# Altium schematic sheet Microcontroller.SchDoc: Microcontroller Sheet (part 1 of 2)
size A3; Author: Kubilay Közleme; Organization: My Company; Address1: Address Line 1; Address2: Address Line 2; Address3: Address Line 3; Address4: Address Line 4; SheetNumber: 3; SheetTotal: 5; ProjectTitle: Drone Fligth Controller
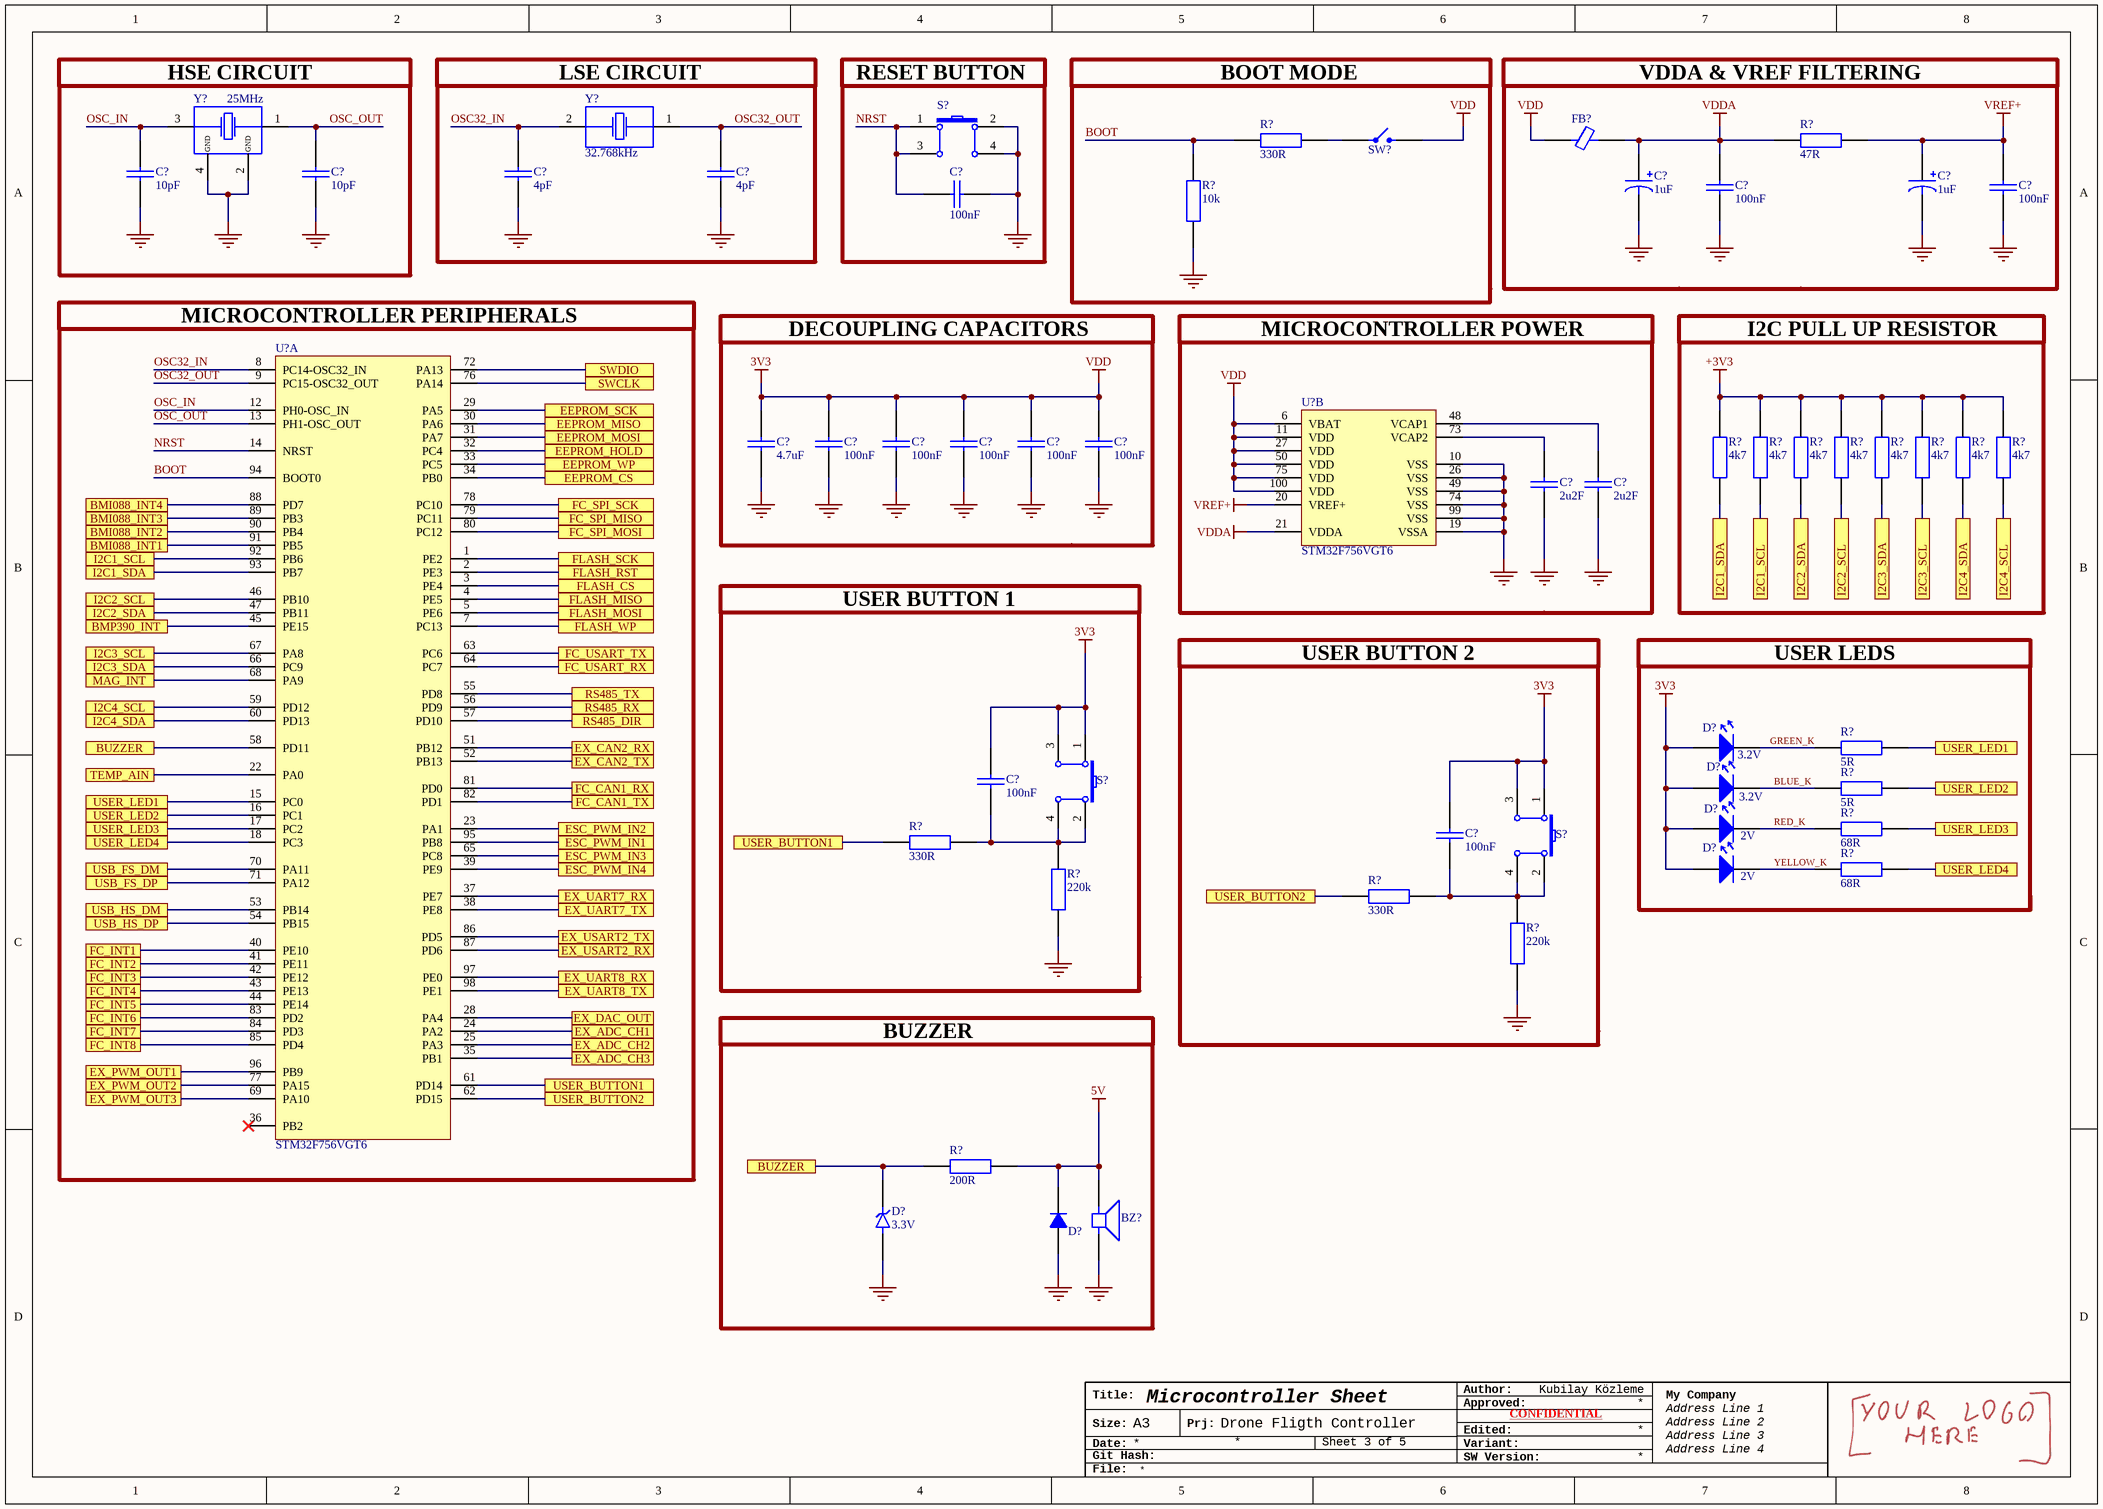
[diagram p0: Microcontroller.SchDoc]

## Parts
(Parts that share a designator on the sheet are numbered #1, #2 ... from top to bottom, then left to right.)
BZ?  CT-1205CL-SMT-TR  [CT-1205CL-SMT-TR]  (value not drawn)
C?#1  Capacitance: 10pF  [CAP_0603]  (hidden comment: C0201C100D3GACTU)
C?#2  Capacitance: 10pF  [CAP_0603]  (hidden comment: C0201C100D3GACTU)
C?#3  value 1uF  [CAP TANT POLAR 0805]  (hidden comment: T58W9105M035C0500)
C?#4  value 1uF  [CAP TANT POLAR 0805]  (hidden comment: T58W9105M035C0500)
C?#5  Capacitance: 100nF  [CAP_0603]  (hidden comment: C0603C104K1RACTU)
C?#6  Capacitance: 4pF  [CAP_0603]  (hidden comment: CBR06C409B5GAC)
C?#7  Capacitance: 4pF  [CAP_0603]  (hidden comment: CBR06C409B5GAC)
C?#8  Capacitance: 100nF  [CAP_0603]  (hidden comment: C0603C104K1RACTU)
C?#9  Capacitance: 100nF  [CAP_0603]  (hidden comment: C0603C104K1RACTU)
C?#10  Capacitance: 4.7uF  [CAP_0805]  (hidden comment: CL21A475KAQNNNE)
C?#11  Capacitance: 100nF  [CAP_0603]  (hidden comment: C0603C104K1RACTU)
C?#12  Capacitance: 100nF  [CAP_0603]  (hidden comment: C0603C104K1RACTU)
C?#13  Capacitance: 100nF  [CAP_0603]  (hidden comment: C0603C104K1RACTU)
C?#14  Capacitance: 100nF  [CAP_0603]  (hidden comment: C0603C104K1RACTU)
C?#15  Capacitance: 100nF  [CAP_0603]  (hidden comment: C0603C104K1RACTU)
C?#16  Capacitance: 2u2F  [CAP_0603]  (hidden comment: CL10A225KO8NNNC)
C?#17  Capacitance: 2u2F  [CAP_0603]  (hidden comment: CL10A225KO8NNNC)
C?#18  Capacitance: 100nF  [CAP_0603]  (hidden comment: C0603C104K1RACTU)
C?#19  Capacitance: 100nF  [CAP_0603]  (hidden comment: C0603C104K1RACTU)
D?#1  Forward Voltage: 3.2V  [LED GREEN CLEAR 0603 SMD]  (hidden comment: 150060GS75000)
D?#2  Forward Voltage: 3.2V  [LED GREEN CLEAR 0603 SMD]  (hidden comment: LED BLUE CLEAR 0603 SMD)
D?#3  Forward Voltage: 2V  [LED GREEN CLEAR 0603 SMD]  (hidden comment: 150060RS75000)
D?#4  Forward Voltage: 2V  [LED GREEN CLEAR 0603 SMD]  (hidden comment: LED YELLOW CLEAR 0603 SMD)
D?#5  1N4148WS  [SOD-323F]  (value not drawn)
D?#6  Zener Voltage: 3.3V  [SOD123]  (hidden comment: MMSZ4684T1G)
FB?  FCM 1608KF-601T03  [FCM 1608KF-601T03]  (value not drawn)
R?#1  Resistance: 330R  [RES_0603]  (hidden comment: RC0603JR-07330RL)
R?#2  Resistance: 47R  [RES_0603]  (hidden comment: RC0603FR-0747RL)
R?#3  Resistance: 10k  [RES_0603]  (hidden comment: RC0603FR-0710KL)
R?#4  Resistance: 4k7  [RES_0603]  (hidden comment: RC0603JR-074K7L)
R?#5  Resistance: 4k7  [RES_0603]  (hidden comment: RC0603JR-074K7L)
R?#6  Resistance: 4k7  [RES_0603]  (hidden comment: RC0603JR-074K7L)
R?#7  Resistance: 4k7  [RES_0603]  (hidden comment: RC0603JR-074K7L)
R?#8  Resistance: 4k7  [RES_0603]  (hidden comment: RC0603JR-074K7L)
R?#9  Resistance: 4k7  [RES_0603]  (hidden comment: RC0603JR-074K7L)
R?#10  Resistance: 4k7  [RES_0603]  (hidden comment: RC0603JR-074K7L)
R?#11  Resistance: 4k7  [RES_0603]  (hidden comment: RC0603JR-074K7L)
R?#12  Resistor Value: 5R  [RES_0603]  (hidden comment: CSRT0603FT5R00)
R?#13  Resistor Value: 5R  [RES_0603]  (hidden comment: CSRT0603FT5R00)
R?#14  Resistance: 68R  [RES_0603]  (hidden comment: RC0603FR-0768RL)
R?#15  Resistance: 330R  [RES_0603]  (hidden comment: RC0603JR-07330RL)
R?#16  Resistance: 68R  [RES_0603]  (hidden comment: RC0603FR-0768RL)
R?#17  Resistance: 330R  [RES_0603]  (hidden comment: RC0603JR-07330RL)
R?#18  value 220k  [RES_0603]  (hidden comment: RC0603JR-07220KL)
R?#19  value 220k  [RES_0603]  (hidden comment: RC0603JR-07220KL)
R?#20  Resistor Value: 200R  [RES_0805]  (hidden comment: RC0805FR-07200RL)
S?#1  PTS 647 SN50 SMTR2 LFS  [PTS 647 SN50 SMTR2 LFS]  (value not drawn)
S?#2  PTS 647 SN50 SMTR2 LFS  [PTS 647 SN50 SMTR2 LFS]  (value not drawn)
S?#3  PTS 647 SN50 SMTR2 LFS  [PTS 647 SN50 SMTR2 LFS]  (value not drawn)
SW?  CHS-01TA  [CHS-01TA]  (value not drawn)
U?#1  STM32F756VGT6  [LQFP-100]  (part A of 2)
U?#2  STM32F756VGT6  [LQFP-100]  (part B of 2)
Y?#1  value 25MHz  [ECS]  (hidden comment: ECS-250-10-37B-CTN-TR)
Y?#2  value 32.768kHz  [ECS-.327-7-16-C-TR]  (hidden comment: ECS-.327-7-16-C-TR)

## Blocks framed on the sheet
HSE CIRCUIT: C?#1 C?#2 Y?#1
LSE CIRCUIT: C?#6 C?#7 Y?#2
RESET BUTTON: C?#5 S?#1
BOOT MODE: R?#1 R?#3 SW?
MICROCONTROLLER PERIPHERALS: U?#1
MICROCONTROLLER POWER: C?#16 C?#17 U?#2
I2C PULL UP RESISTOR: R?#4-R?#11
BUZZER: BZ? D?#5 D?#6 R?#20

## Ports
BMI088_INT1 (see Peripherals[3A]), BMI088_INT2 (see Peripherals[3A]), BMI088_INT3 (see Peripherals[3A]), BMI088_INT4 (see Peripherals[3A]), BMP390_INT (see Peripherals[2B]), BUZZER (see Microcontroller[1B]), BUZZER (see Microcontroller[3D]), EEPROM_CS (see Peripherals[3B]), EEPROM_HOLD (see Peripherals[3B]), EEPROM_MISO (see Peripherals[3B]), EEPROM_MOSI (see Peripherals[3B]), EEPROM_SCK (see Peripherals[3B]), EEPROM_WP (see Peripherals[3B]), ESC_PWM_IN1 (see Connector[5A]), ESC_PWM_IN2 (see Connector[6A]), ESC_PWM_IN3 (see Connector[5A]), ESC_PWM_IN4 (see Connector[6A]), EX_ADC_CH1 (see Connector[7C]), EX_ADC_CH2 (see Connector[7C]), EX_ADC_CH3 (see Connector[7C]), EX_CAN2_RX (see Connector[3B]), EX_CAN2_TX (see Connector[3B]), EX_DAC_OUT (see Connector[7C]), EX_PWM_OUT1 (see Connector[7D]), EX_PWM_OUT2 (see Connector[7D]), EX_PWM_OUT3 (see Connector[7D]), EX_UART7_RX (see Connector[7B]), EX_UART7_TX (see Connector[7B]), EX_UART8_RX (see Connector[7B]), EX_UART8_TX (see Connector[7B]), EX_USART2_RX (see Connector[7A]), EX_USART2_TX (see Connector[7A]), FC_CAN1_RX (see Connector[1B]), FC_CAN1_TX (see Connector[1B]), FC_INT1 (see Connector[1C]), FC_INT2 (see Connector[1C]), FC_INT3 (see Connector[1C]), FC_INT4 (see Connector[1C]), FC_INT5 (see Connector[1C]), FC_INT6 (see Connector[1C]), FC_INT7 (see Connector[1C]), FC_INT8 (see Connector[1C]), FC_SPI_MISO (see Connector[1C]), FC_SPI_MOSI (see Connector[1C]), FC_SPI_SCK (see Connector[1C]), FC_USART_RX (see Connector[1B]), FC_USART_TX (see Connector[1B]), FLASH_CS (see Peripherals[1C]), FLASH_MISO (see Peripherals[1B]), FLASH_MOSI (see Peripherals[1B]), FLASH_RST (see Peripherals[2B]), FLASH_SCK (see Peripherals[1B]), FLASH_WP (see Peripherals[2B]), I2C1_SCL (see Microcontroller[1B], Peripherals[1A]), I2C1_SCL (see Microcontroller[7B], Peripherals[1A]), I2C1_SDA (see Microcontroller[1B], Peripherals[1A]), I2C1_SDA (see Microcontroller[7B], Peripherals[1A]), I2C2_SCL (see Microcontroller[1B], Peripherals[2B]), I2C2_SCL (see Microcontroller[8B], Peripherals[2B]), I2C2_SDA (see Microcontroller[1B], Peripherals[2B]), I2C2_SDA (see Microcontroller[7B], Peripherals[2B]), I2C3_SCL (see Microcontroller[1B], Peripherals[5A], Peripherals[5B]), I2C3_SCL (see Microcontroller[8B], Peripherals[5A], Peripherals[5B]), I2C3_SDA (see Microcontroller[1B], Peripherals[5A], Peripherals[5B]), I2C3_SDA (see Microcontroller[8B], Peripherals[5A], Peripherals[5B]), I2C4_SCL (see Connector[1B], Connector[7C], Microcontroller[1B]), I2C4_SCL (see Connector[1B], Connector[7C], Microcontroller[8B]), I2C4_SDA (see Connector[1B], Connector[7C], Microcontroller[1B]), I2C4_SDA (see Connector[1B], Connector[7C], Microcontroller[8B]), MAG_INT (see Peripherals[5A]), RS485_DIR, RS485_RX, RS485_TX, SWCLK (see Connector[2D]), SWDIO (see Connector[2D]), TEMP_AIN, USB_FS_DM (see Connector[4A]), USB_FS_DP (see Connector[4A]), USB_HS_DM (see Connector[6C]), USB_HS_DP (see Connector[6C]), USER_BUTTON1 (see Microcontroller[3C]), USER_BUTTON2 (see Microcontroller[3C]), USER_BUTTON2 (see Microcontroller[5C]), USER_LED1 (see Microcontroller[1C]), USER_LED1 (see Microcontroller[8B]), USER_LED2 (see Microcontroller[1C]), USER_LED2 (see Microcontroller[8C]), USER_LED3 (see Microcontroller[1C]), USER_LED3 (see Microcontroller[8C]), USER_LED4 (see Microcontroller[1C]), USER_LED4 (see Microcontroller[8C])

## Nets
3V3: C?#10.2 C?#11.2 C?#12.2 C?#13.2 C?#14.2 C?#15.2 C?#18.2 C?#19.2 D?#1.2(A) D?#2.2(A) D?#3.2(A) D?#4.2(A) FB?.1 S?#2.1 S?#2.3 S?#3.1 S?#3.3 SW?.1 U?#2.6(VBAT) U?#2.11(VDD) U?#2.27(VDD) U?#2.50(VDD) U?#2.75(VDD) U?#2.100(VDD)  [also labelled VDD]
5V: BZ?.1(+) D?#5.1 R?#20.1
+3V3: R?#4.2 R?#5.2 R?#6.2 R?#7.2 R?#8.2 R?#9.2 R?#10.2 R?#11.2
GND: BZ?.2(-) C?#1.2 C?#2.2 C?#3.2 C?#4.2 C?#5.2 C?#6.1 C?#7.1 C?#8.1 C?#9.1 C?#10.1 C?#11.1 C?#12.1 C?#13.1 C?#14.1 C?#15.1 C?#16.1 C?#17.1 D?#5.2 D?#6.A R?#3.1 R?#18.1 R?#19.1 S?#1.2 S?#1.4 U?#2.10(VSS) U?#2.19(VSSA) U?#2.26(VSS) U?#2.49(VSS) U?#2.74(VSS) U?#2.99(VSS) Y?#1.2(GND) Y?#1.4(GND)
VDDA: C?#3.1 C?#8.2 FB?.2 R?#2.1 U?#2.21(VDDA)
VREF+: C?#4.1 C?#9.2 R?#2.2 U?#2.20(VREF+)
BLUE_K: D?#2.1(K) R?#13.1
BMI088_INT1: U?#1.91(PB5) ; port BMI088_INT1
BMI088_INT2: U?#1.90(PB4) ; port BMI088_INT2
BMI088_INT3: U?#1.89(PB3) ; port BMI088_INT3
BMI088_INT4: U?#1.88(PD7) ; port BMI088_INT4
BMP390_INT: U?#1.45(PE15) ; port BMP390_INT
BOOT: R?#1.1 R?#3.2 U?#1.94(BOOT0)
BUZZER: D?#6.K R?#20.2 U?#1.58(PD11) ; port BUZZER
EEPROM_CS: U?#1.34(PB0) ; port EEPROM_CS
EEPROM_HOLD: U?#1.32(PC4) ; port EEPROM_HOLD
EEPROM_MISO: U?#1.30(PA6) ; port EEPROM_MISO
EEPROM_MOSI: U?#1.31(PA7) ; port EEPROM_MOSI
EEPROM_SCK: U?#1.29(PA5) ; port EEPROM_SCK
EEPROM_WP: U?#1.33(PC5) ; port EEPROM_WP
ESC_PWM_IN1: U?#1.95(PB8) ; port ESC_PWM_IN1
ESC_PWM_IN2: U?#1.23(PA1) ; port ESC_PWM_IN2
ESC_PWM_IN3: U?#1.65(PC8) ; port ESC_PWM_IN3
ESC_PWM_IN4: U?#1.39(PE9) ; port ESC_PWM_IN4
EX_ADC_CH1: U?#1.24(PA2) ; port EX_ADC_CH1
EX_ADC_CH2: U?#1.25(PA3) ; port EX_ADC_CH2
EX_ADC_CH3: U?#1.35(PB1) ; port EX_ADC_CH3
EX_CAN2_RX: U?#1.51(PB12) ; port EX_CAN2_RX
EX_CAN2_TX: U?#1.52(PB13) ; port EX_CAN2_TX
EX_DAC_OUT: U?#1.28(PA4) ; port EX_DAC_OUT
EX_PWM_OUT1: U?#1.96(PB9) ; port EX_PWM_OUT1
EX_PWM_OUT2: U?#1.77(PA15) ; port EX_PWM_OUT2
EX_PWM_OUT3: U?#1.69(PA10) ; port EX_PWM_OUT3
EX_UART7_RX: U?#1.37(PE7) ; port EX_UART7_RX
EX_UART7_TX: U?#1.38(PE8) ; port EX_UART7_TX
EX_UART8_RX: U?#1.97(PE0) ; port EX_UART8_RX
EX_UART8_TX: U?#1.98(PE1) ; port EX_UART8_TX
EX_USART2_RX: U?#1.87(PD6) ; port EX_USART2_RX
EX_USART2_TX: U?#1.86(PD5) ; port EX_USART2_TX
FC_CAN1_RX: U?#1.81(PD0) ; port FC_CAN1_RX
FC_CAN1_TX: U?#1.82(PD1) ; port FC_CAN1_TX
FC_INT1: U?#1.40(PE10) ; port FC_INT1
FC_INT2: U?#1.41(PE11) ; port FC_INT2
FC_INT3: U?#1.42(PE12) ; port FC_INT3
FC_INT4: U?#1.43(PE13) ; port FC_INT4
FC_INT5: U?#1.44(PE14) ; port FC_INT5
FC_INT6: U?#1.83(PD2) ; port FC_INT6
FC_INT7: U?#1.84(PD3) ; port FC_INT7
FC_INT8: U?#1.85(PD4) ; port FC_INT8
FC_SPI_MISO: U?#1.79(PC11) ; port FC_SPI_MISO
FC_SPI_MOSI: U?#1.80(PC12) ; port FC_SPI_MOSI
FC_SPI_SCK: U?#1.78(PC10) ; port FC_SPI_SCK
FC_USART_RX: U?#1.64(PC7) ; port FC_USART_RX
FC_USART_TX: U?#1.63(PC6) ; port FC_USART_TX
FLASH_CS: U?#1.3(PE4) ; port FLASH_CS
FLASH_MISO: U?#1.4(PE5) ; port FLASH_MISO
FLASH_MOSI: U?#1.5(PE6) ; port FLASH_MOSI
FLASH_RST: U?#1.2(PE3) ; port FLASH_RST
FLASH_SCK: U?#1.1(PE2) ; port FLASH_SCK
FLASH_WP: U?#1.7(PC13) ; port FLASH_WP
GREEN_K: D?#1.1(K) R?#12.1
I2C1_SCL: R?#5.1 U?#1.92(PB6) ; port I2C1_SCL
I2C1_SDA: R?#4.1 U?#1.93(PB7) ; port I2C1_SDA
I2C2_SCL: R?#7.1 U?#1.46(PB10) ; port I2C2_SCL
I2C2_SDA: R?#6.1 U?#1.47(PB11) ; port I2C2_SDA
I2C3_SCL: R?#9.1 U?#1.67(PA8) ; port I2C3_SCL
I2C3_SDA: R?#8.1 U?#1.66(PC9) ; port I2C3_SDA
I2C4_SCL: R?#11.1 U?#1.59(PD12) ; port I2C4_SCL
I2C4_SDA: R?#10.1 U?#1.60(PD13) ; port I2C4_SDA
MAG_INT: U?#1.68(PA9) ; port MAG_INT
NRST: C?#5.1 S?#1.1 S?#1.3 U?#1.14(NRST)
OSC32_IN: C?#6.2 U?#1.8(PC14-OSC32_IN) Y?#2.2
OSC32_OUT: C?#7.2 U?#1.9(PC15-OSC32_OUT) Y?#2.1
OSC_IN: C?#1.1 U?#1.12(PH0-OSC_IN) Y?#1.3
OSC_OUT: C?#2.1 U?#1.13(PH1-OSC_OUT) Y?#1.1
RED_K: D?#3.1(K) R?#14.1
RS485_DIR: U?#1.57(PD10) ; port RS485_DIR
RS485_RX: U?#1.56(PD9) ; port RS485_RX
RS485_TX: U?#1.55(PD8) ; port RS485_TX
SWCLK: U?#1.76(PA14) ; port SWCLK
SWDIO: U?#1.72(PA13) ; port SWDIO
TEMP_AIN: U?#1.22(PA0) ; port TEMP_AIN
USB_FS_DM: U?#1.70(PA11) ; port USB_FS_DM
USB_FS_DP: U?#1.71(PA12) ; port USB_FS_DP
USB_HS_DM: U?#1.53(PB14) ; port USB_HS_DM
USB_HS_DP: U?#1.54(PB15) ; port USB_HS_DP
USER_BUTTON1: R?#15.2 U?#1.61(PD14) ; port USER_BUTTON1
USER_BUTTON2: R?#17.2 U?#1.62(PD15) ; port USER_BUTTON2
USER_LED1: R?#12.2 U?#1.15(PC0) ; port USER_LED1
USER_LED2: R?#13.2 U?#1.16(PC1) ; port USER_LED2
USER_LED3: R?#14.2 U?#1.17(PC2) ; port USER_LED3
USER_LED4: R?#16.2 U?#1.18(PC3) ; port USER_LED4
YELLOW_K: D?#4.1(K) R?#16.1
NetC?#16_2: C?#16.2 U?#2.73(VCAP2)
NetC?#17_2: C?#17.2 U?#2.48(VCAP1)
NetC?#18_1: C?#18.1 R?#15.1 R?#18.2 S?#2.2 S?#2.4
NetC?#19_1: C?#19.1 R?#17.1 R?#19.2 S?#3.2 S?#3.4
NetR?#1_2: R?#1.2 SW?.2

Not connected (* = marked no-connect by the designer): U?#1 36(PB2)*

## Notes on the sheet
- VDDA & VREF FILTERING
- DECOUPLING CAPACITORS
- 100nF lık kapasitörler işlemciye yakın yerleştirilecek
- (near U?#1) Yapılacaklar
  - HSE ve LSE kristalleri için load kapasitans değerleri (Cstray = 5nF) alınarak tekrar hesaplanılacak
  -Buzzer ve ledler için ayrı ayrı transistör tabanlı anahtarlama devresi tasarımı yapılacak
  -USB FS ve HS modlarını destekleyen konnektörler seçilecek ve dif hatların şematik tasarımı yapılacak
  -Kullanıcı butonu devreleri yapılacak (1 tane Pull up 1 tane Pull down olmak üzere )
  -Can Bus ve RS485 diferansiyel hatlar için şematik çizimi yapılacak (TVS diyot , ESC koruması ve pi filtera bakılacak)
  -PCA9685PW,118 servo sürücüsü tasarımı yapılacak (Yer Kalmadı Uçuş Bilgisayarında Bu Yapılacak)
- (near C?#15) 100nF lık kapasitörler işlemciye yakın yerleştirilecek
- USER BUTTON 1
- USER BUTTON 2
- USER LEDS
- Title:
- Author:
- Approved:
- Size:
- Date:
- Git Hash:
- A3
- Prj:
- SW Version:
- Variant:
- Edited:
- CONFIDENTIAL
- File: